# Altium schematic sheet 02_Connectors.SchDoc: Off Board Connectors
size A; Revision: A; SheetNumber: 2; SheetTotal: 4; ECE315_Project_Name: ECE453 F23 Base Project
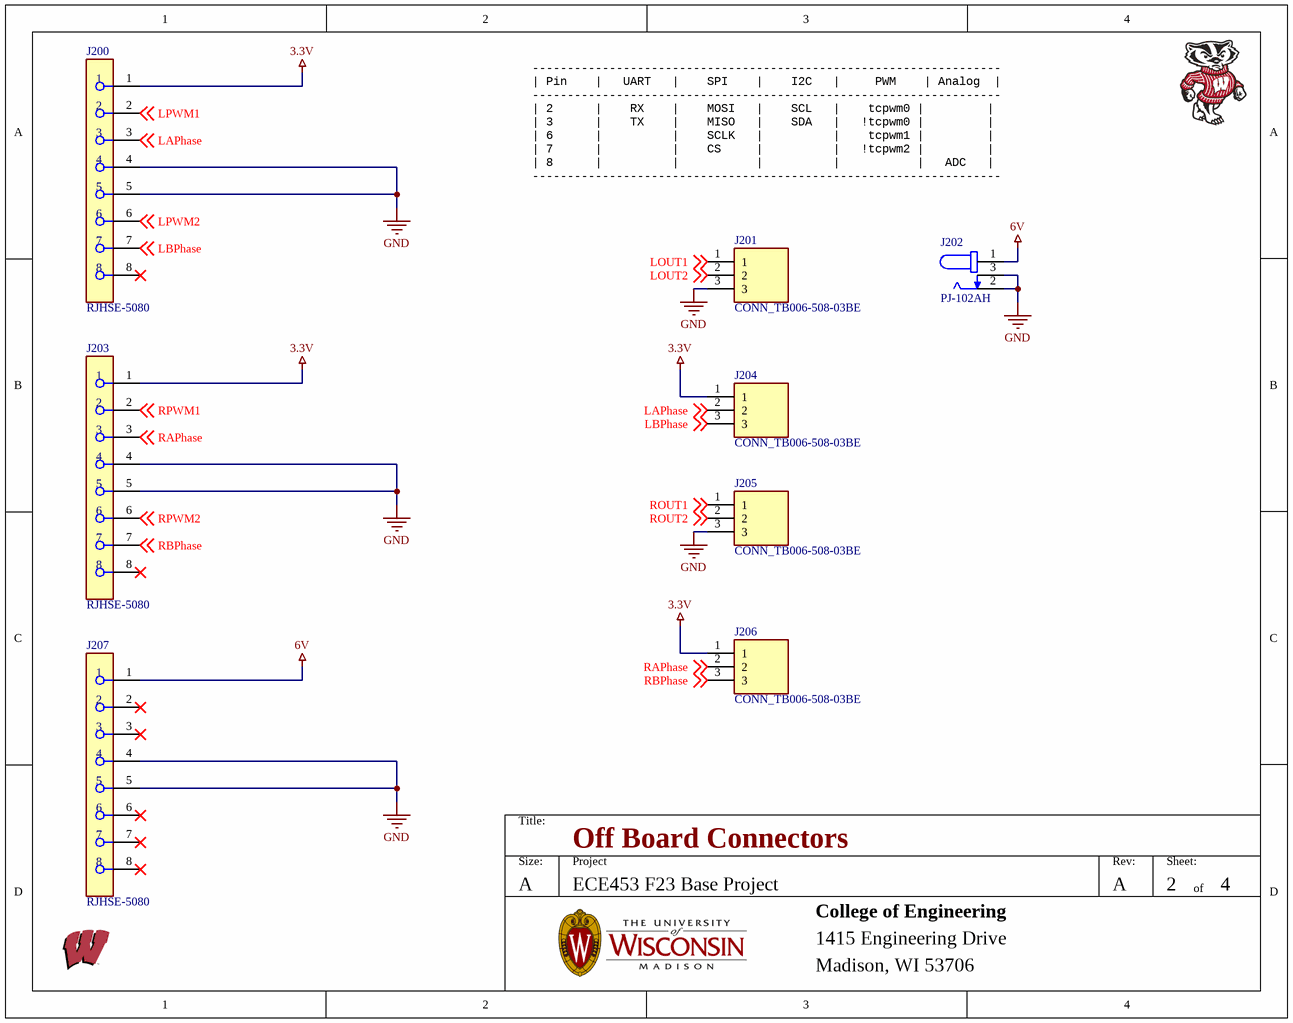
[diagram p0: 02_Connectors.SchDoc]

## Parts
J200  RJHSE-5080  [FP-RJHSE-5080-MFG]
J201  CONN_TB006-508-03BE  [CUI_TB006-508-03BE]
J202  PJ-102AH  [CUI_PJ-102AH]
J203  RJHSE-5080  [FP-RJHSE-5080-MFG]
J204  CONN_TB006-508-03BE  [CUI_TB006-508-03BE]
J205  CONN_TB006-508-03BE  [CUI_TB006-508-03BE]
J206  CONN_TB006-508-03BE  [CUI_TB006-508-03BE]
J207  RJHSE-5080  [FP-RJHSE-5080-MFG]

## Nets
3.3V: J200.1 J203.1 J204.1 J206.1
6V: J202.1 J207.1
GND: J200.4 J200.5 J201.3 J202.2 J202.3 J203.4 J203.5 J205.3 J207.4 J207.5
LAPhase: J200.3 J204.2 ; off-sheet LAPhase
LBPhase: J200.7 J204.3 ; off-sheet LBPhase
LOUT1: J201.1 ; off-sheet LOUT1
LOUT2: J201.2 ; off-sheet LOUT2
LPWM1: J200.2 ; off-sheet LPWM1
LPWM2: J200.6 ; off-sheet LPWM2
RAPhase: J203.3 J206.2 ; off-sheet RAPhase
RBPhase: J203.7 J206.3 ; off-sheet RBPhase
ROUT1: J205.1 ; off-sheet ROUT1
ROUT2: J205.2 ; off-sheet ROUT2
RPWM1: J203.2 ; off-sheet RPWM1
RPWM2: J203.6 ; off-sheet RPWM2

Not connected (* = marked no-connect by the designer): J200 8*; J203 8*; J207 2* 3* 6* 7* 8*

## Notes on the sheet
- -------------------------------------------------------------------
  | Pin    |   UART   |    SPI    |    I2C   |     PWM    | Analog  |
  -------------------------------------------------------------------
  | 2      |    RX    |    MOSI   |    SCL   |    tcpwm0 |         |
  | 3      |    TX    |    MISO   |    SDA   |   !tcpwm0 |         |
  | 6      |          |    SCLK   |          |    tcpwm1 |         |
  | 7      |          |    CS     |          |   !tcpwm2 |         |
  | 8      |          |           |          |           |   ADC   |
  -------------------------------------------------------------------
- Title:
- Size:
- A
- Project
- Rev:
- Sheet:
- of
- College of Engineering
- 1415 Engineering Drive
- Madison, WI 53706

## Library data of the parts
J200 J203 J207 = CMP-02366-000003-1: CONN MOD JACK 8P8C R/A UNSHLD; Manufacturer: Amphenol; Current Rating: 1.5A; Voltage Rating: 125V; Pitch: 1.02mm; Conn Orientation: Right Angle; Number Of Contacts: 8; Is Female: yes; Conn Gender: Female; Lead Free: Yes; Device Class L3: unset; Footprint Url: https://cdn.amphenol-icc.com/media/wysiwyg/files/drawing/rjhse5080.pdf?__cf_chl_jschl_tk__=e349db0bbbb6188a39347cd5e541b92fa02c9719-1587748343-0-AW7tChdeHzRPLX9gSWj7WrKaXQoY9BsmT9Ek0h-T62M9y3Rs9iypFcOtkzb-6sGYQEjFE-jcoNciDETCOZrh1rYyOesac5SvYLoLwHIsHvF4AKBlx-MXmfZUVk9OTTJLqyQq2qMm0PFRLJpNcK0nrKResqOniRSYixG2sPTmOPraH-ULJFBDL602CHqcI9KKBgTq90Jh1OL2Td4moJ99rFsJRJ1Tk_uoxGe8ublcP_ARu-uLpWcQrBcwOcHDTAwL29DAwVaqcH7ta8Ks7WMlHmVl_pILeEDwT0bE9vu5Pa5S3PtNRF1leuFkgi_FMbUxTDulc5xzbXSfng8srUIV1lWXny5nx1fZJEUa_w97yKjffzBMxiWLWVN-V7-uqAaPbyv_m-wRyw5O25OZNyJOeGU; ComponentLink2URL: https://cdn.amphenol-icc.com/media/wysiwyg/files/documentation/datasheet/inputoutput/io-modjack-rjhse.pdf; Device Class L1: Connectors; Package: CONN_MOD_JACK; Mouser Description: Modular Connectors / Ethernet Connectors R/A RJ45 NONSHIELDED 8 CONT NO LEDS; Manufacturer Part Number: RJHSE-5080; Octopart: https://octopart.com/rjhse-5080-amphenol-45060; Category: Conn; Height: 0.535inch; Temperature: -55°C to +85°C; Digikey Description: CONN MOD JACK 8P8C R/A UNSHLD; Device Class L2: Modular / Ethernet Connectors; Contact Material: Gold,Nickel; ComponentLink2Description: Datasheet; Temperature Range Low: -55°C; RoHS: TRUE; Automotive: No; Temperature Range High: +85°C
J201 J204-J206 = CONN_TB006-508-03BE: 2~24 Poles, Screw Type, Horizontal, 5.08 Pitch, 26~14 (AWG), Terminal Block Connector; MF: CUI Devices; Price: None; CUI_purchase_URL: https://www.cuidevices.com/product/interconnect/connectors/terminal-blocks/tb006-508-series?utm_source=snapeda.com&utm_medium=referral&utm_campaign=snapedaBOM; Purchase-URL: https://pricing.snapeda.com/search/part/TB006-508-03BE/?ref=eda; MP: TB006-508-03BE; Value: *; Package: None; SnapEDA_Link: https://www.snapeda.com/parts/TB006-508-03BE/CUI+Devices/view-part/?ref=snap; Availability: In Stock; Check_prices: https://www.snapeda.com/parts/TB006-508-03BE/CUI+Devices/view-part/?ref=eda
J202 = CONN_PJ-102AH: 2.0 x 6.5 mm, 5.0 A, Horizontal, Through Hole, Tapered Pins, Dc Power Jack Connector; Manufacturer: CUI; MF: {'manufacturer': u'CUI Devices'}; Number of Conductors: 2; Shielding: Unshielded; Package: None; Price: None; Value: *; MP: PJ-102AH; Availability: Unavailable; Supplier: Digikey; Supplier Part Number: CP-102AH-ND; Manufacturer Part Number: PJ-102AH; RoHS: Yes; Category: Uncategorized; Stock: 76168; Pricing: 1=0.700000, 10=0.590000, 25=0.566000, 40=0.553750, 200=0.529750, 400=0.481600, 600=0.433430, 1000=0.385280, 2400=0.349160 (USD); Orientation: Horizontal; Packaging: Bulk; Termination: Through Hole; Connector Type: Jack; Diameter: 2.1mm; Lead Free: Lead Free; RoHS Compliant: Yes; ComponentLink1URL: http://www.mouser.com/ds/2/670/PJ-102AH-524179.pdf?src-supplier=Mouser; ComponentLink1Description: http://www.mouser.com/ds/2/670/PJ-102AH-524179.pdf?src-supplier=Mouser; ComponentLink2URL: https://www.cui.com/product/resource/digikeypdf/pj-102ah.pdf?src-supplier=Digikey; ComponentLink2Description: https://www.cui.com/product/resource/digikeypdf/pj-102ah.pdf?src-supplier=Digikey; ComponentLink3URL: http://www.cui.com/Product/Resource/FuturePDF/PJ-102AH.pdf?src-supplier=Future+Electronics; ComponentLink3Description: http://www.cui.com/Product/Resource/FuturePDF/PJ-102AH.pdf?src-supplier=Future+Electronics